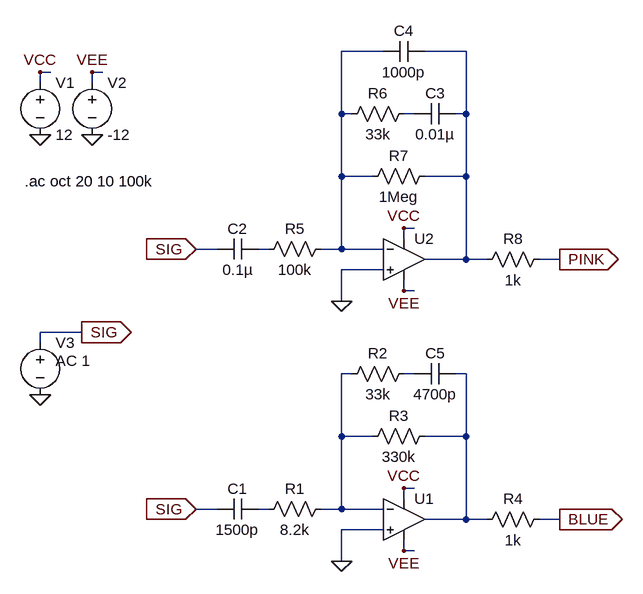
[diagram p0: schematic NOS02_Blue.asc]
NOS02_Blue.asc, the LTspice schematic file:
Version 4
SHEET 1 1352 1156
WIRE 240 -240 176 -240
WIRE 368 -240 304 -240
WIRE -272 -208 -288 -208
WIRE -192 -208 -208 -208
WIRE -288 -192 -288 -208
WIRE -208 -192 -208 -208
WIRE 176 -144 176 -240
WIRE 192 -144 176 -144
WIRE 288 -144 272 -144
WIRE 368 -144 368 -240
WIRE 368 -144 352 -144
WIRE 176 -48 176 -144
WIRE 224 -48 176 -48
WIRE 368 -48 368 -144
WIRE 368 -48 304 -48
WIRE 288 32 272 32
WIRE 272 48 272 32
WIRE -16 64 -48 64
WIRE 64 64 48 64
WIRE 176 64 176 -48
WIRE 176 64 144 64
WIRE 240 64 176 64
WIRE 368 80 368 -48
WIRE 368 80 304 80
WIRE 400 80 368 80
WIRE 512 80 480 80
WIRE 240 96 176 96
WIRE 272 128 272 112
WIRE 288 128 272 128
WIRE 176 144 176 96
WIRE -224 192 -288 192
WIRE -288 208 -288 192
WIRE 192 256 176 256
WIRE 288 256 272 256
WIRE 368 256 352 256
WIRE 176 352 176 256
WIRE 224 352 176 352
WIRE 368 352 368 256
WIRE 368 352 304 352
WIRE 288 432 272 432
WIRE 272 448 272 432
WIRE -16 464 -48 464
WIRE 64 464 48 464
WIRE 176 464 176 352
WIRE 176 464 144 464
WIRE 240 464 176 464
WIRE 368 480 368 352
WIRE 368 480 304 480
WIRE 400 480 368 480
WIRE 512 480 480 480
WIRE 240 496 176 496
WIRE 272 528 272 512
WIRE 288 528 272 528
WIRE 176 544 176 496
FLAG 272 32 VCC
FLAG 272 128 VEE
FLAG 176 144 0
FLAG -48 64 SIG
IOPIN -48 64 In
FLAG 512 80 PINK
IOPIN 512 80 Out
FLAG -288 -112 0
FLAG -208 -112 0
FLAG -288 -208 VCC
FLAG -208 -208 VEE
FLAG -224 192 SIG
IOPIN -224 192 Out
FLAG -288 288 0
FLAG 272 432 VCC
FLAG 272 528 VEE
FLAG 176 544 0
FLAG -48 464 SIG
IOPIN -48 464 In
FLAG 512 480 BLUE
IOPIN 512 480 Out
SYMBOL Opamps\\UniversalOpamp2 272 80 R0
SYMATTR InstName U2
SYMBOL res 160 48 R90
WINDOW 0 0 56 VBottom 2
WINDOW 3 32 56 VTop 2
SYMATTR InstName R5
SYMATTR Value 100k
SYMBOL cap 48 48 R90
WINDOW 0 0 32 VBottom 2
WINDOW 3 32 32 VTop 2
SYMATTR InstName C2
SYMATTR Value 0.1µ
SYMBOL res 288 -160 R90
WINDOW 0 0 56 VBottom 2
WINDOW 3 32 56 VTop 2
SYMATTR InstName R6
SYMATTR Value 33k
SYMBOL res 320 -64 R90
WINDOW 0 0 56 VBottom 2
WINDOW 3 32 56 VTop 2
SYMATTR InstName R7
SYMATTR Value 1Meg
SYMBOL res 496 64 R90
WINDOW 0 0 56 VBottom 2
WINDOW 3 32 56 VTop 2
SYMATTR InstName R8
SYMATTR Value 1k
SYMBOL cap 352 -160 R90
WINDOW 0 0 32 VBottom 2
WINDOW 3 32 32 VTop 2
SYMATTR InstName C3
SYMATTR Value 0.01µ
SYMBOL cap 304 -256 R90
WINDOW 0 0 32 VBottom 2
WINDOW 3 32 32 VTop 2
SYMATTR InstName C4
SYMATTR Value 1000p
SYMBOL voltage -288 -208 R0
WINDOW 123 0 0 Left 0
WINDOW 39 0 0 Left 0
SYMATTR InstName V1
SYMATTR Value 12
SYMBOL voltage -208 -208 R0
WINDOW 123 0 0 Left 0
WINDOW 39 0 0 Left 0
SYMATTR InstName V2
SYMATTR Value -12
SYMBOL voltage -288 192 R0
WINDOW 123 24 44 Left 2
WINDOW 39 0 0 Left 0
SYMATTR Value2 AC 1
SYMATTR InstName V3
SYMATTR Value ""
SYMBOL Opamps\\UniversalOpamp2 272 480 R0
SYMATTR InstName U1
SYMBOL res 160 448 R90
WINDOW 0 0 56 VBottom 2
WINDOW 3 32 56 VTop 2
SYMATTR InstName R1
SYMATTR Value 8.2k
SYMBOL cap 48 448 R90
WINDOW 0 0 32 VBottom 2
WINDOW 3 32 32 VTop 2
SYMATTR InstName C1
SYMATTR Value 1500p
SYMBOL res 496 464 R90
WINDOW 0 0 56 VBottom 2
WINDOW 3 32 56 VTop 2
SYMATTR InstName R4
SYMATTR Value 1k
SYMBOL res 288 240 R90
WINDOW 0 0 56 VBottom 2
WINDOW 3 32 56 VTop 2
SYMATTR InstName R2
SYMATTR Value 33k
SYMBOL cap 352 240 R90
WINDOW 0 0 32 VBottom 2
WINDOW 3 32 32 VTop 2
SYMATTR InstName C5
SYMATTR Value 4700p
SYMBOL res 320 336 R90
WINDOW 0 0 56 VBottom 2
WINDOW 3 32 56 VTop 2
SYMATTR InstName R3
SYMATTR Value 330k
TEXT -312 -40 Left 2 !.ac oct 20 10 100k

The netlist it stands for:
* NOS02_Blue.asc
XU2 0 N001 VCC VEE N002 level.2 Avol=1Meg GBW=10Meg Slew=10Meg ilimit=25m rail=0 Vos=0 phimargin=45 en=0 enk=0 in=0 ink=0 Rin=500Meg  ; pins IN+ IN- V+ V- OUT
R5 N001 N004 100k
C2 N004 SIG 0.1µ
R6 N003 N001 33k
R7 N002 N001 1Meg
R8 PINK N002 1k
C3 N002 N003 0.01µ
C4 N002 N001 1000p
V1 VCC 0 12
V2 VEE 0 -12
V3 SIG 0 AC 1
XU1 0 N005 VCC VEE N007 level.2 Avol=1Meg GBW=10Meg Slew=10Meg ilimit=25m rail=0 Vos=0 phimargin=45 en=0 enk=0 in=0 ink=0 Rin=500Meg  ; pins IN+ IN- V+ V- OUT
R1 N005 N008 8.2k
C1 N008 SIG 1500p
R4 BLUE N007 1k
R2 N006 N005 33k
C5 N007 N006 4700p
R3 N007 N005 330k
.ac oct 20 10 100k
.lib UniversalOpamps2.sub
.backanno
.end